# Altium schematic sheet Interfaces.SchDoc: PSM Interfaces
size A4; Author: SCH Originator; CompanyName: Invenco Group Ltd; DrawnBy: PCB Originator; Address1: 7-11 Kawana Street; Address2: Northcote; Address3: Auckland 0627; Address4: New Zealand; Revision: Use ProjectOptions->Parameters->ProjectRevision; SheetNumber: 2; SheetTotal: 2; PageSetup: Record=PageOptions|CenterHorizontal=True|CenterVertical=True|PrintScale=0.97|XCorrection=1.00|YCorrection=1.00|PrintKind=0|BorderSize=5000000|LeftOffset=0|BottomOffset=0|Orientation=2|PaperLength=1000|PaperWidth=1000|Scale=100|PaperSource=7|PrintQuality=-4|MediaType=1|DitherType=10|PaperKind=A4|PrintScaleMode=1; ContactDetails: www.invenco.com; Designer: Jasper M-W
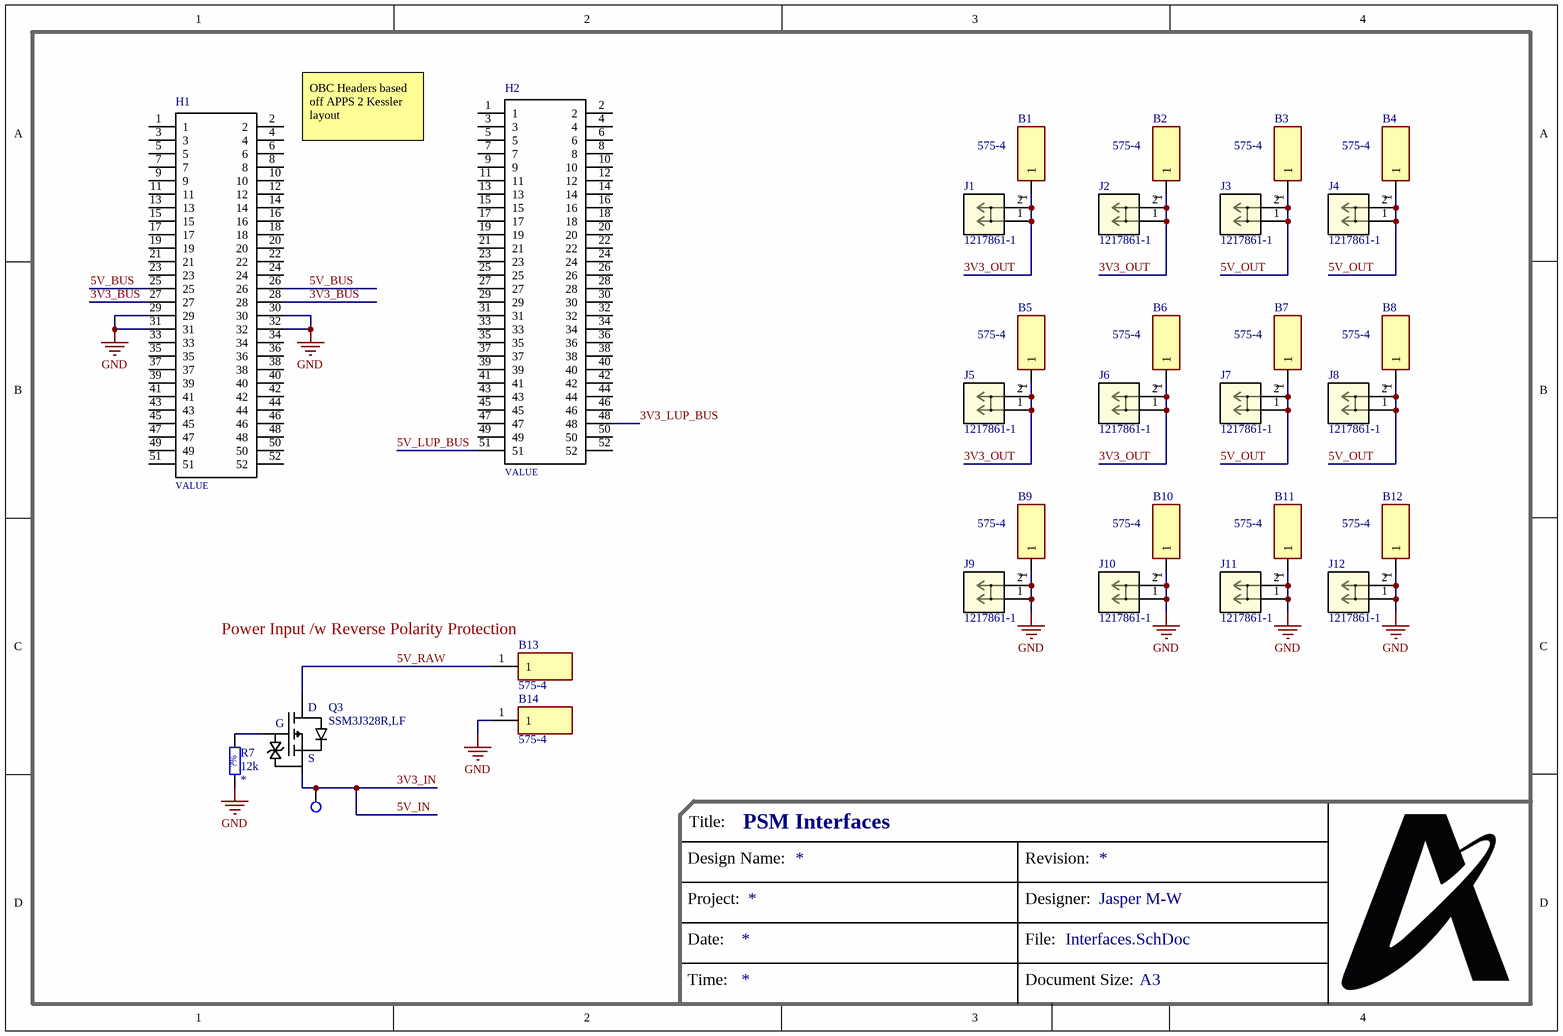
[diagram p0: Interfaces.SchDoc]

## Parts
B1  575-4  [5754]
B2  575-4  [5754]
B3  575-4  [5754]
B4  575-4  [5754]
B5  575-4  [5754]
B6  575-4  [5754]
B7  575-4  [5754]
B8  575-4  [5754]
B9  575-4  [5754]
B10  575-4  [5754]
B11  575-4  [5754]
B12  575-4  [5754]
B13  575-4  [5754]
B14  575-4  [5754]
H1  ESQ-126-14-G-D  [*SAMTEC_ESQ-126-14-G-D]  (value not drawn)
H2  ESQ-126-14-G-D  [*SAMTEC_ESQ-126-14-G-D]  (value not drawn)
J1  1217861-1  [CONN_1217861-1_TEC]
J2  1217861-1  [CONN_1217861-1_TEC]
J3  1217861-1  [CONN_1217861-1_TEC]
J4  1217861-1  [CONN_1217861-1_TEC]
J5  1217861-1  [CONN_1217861-1_TEC]
J6  1217861-1  [CONN_1217861-1_TEC]
J7  1217861-1  [CONN_1217861-1_TEC]
J8  1217861-1  [CONN_1217861-1_TEC]
J9  1217861-1  [CONN_1217861-1_TEC]
J10  1217861-1  [CONN_1217861-1_TEC]
J11  1217861-1  [CONN_1217861-1_TEC]
J12  1217861-1  [CONN_1217861-1_TEC]
Q3  SSM3J328R,LF  [SOT23F-3-0.8mm]
R7  12k  [RESISTOR_0805_2012M-50N]
T1  Test Pad  [Test Pad]  (value not drawn)  (no BOM)

## Nets
GND: B9.1 B10.1 B11.1 B12.1 B14.1 H1.29 H1.30 H1.31 H1.32 J9.1 J9.2 J10.1 J10.2 J11.1 J11.2 J12.1 J12.2 R7.1
3V3_BUS: H1.27 H1.28
3V3_IN: Q3.2(S) T1.1  [also labelled 5V_IN]
3V3_LUP_BUS: H2.48
3V3_OUT: B1.1 B2.1 B5.1 B6.1 J1.1 J1.2 J2.1 J2.2 J5.1 J5.2 J6.1 J6.2
5V_BUS: H1.25 H1.26
5V_LUP_BUS: H2.51
5V_OUT: B3.1 B4.1 B7.1 B8.1 J3.1 J3.2 J4.1 J4.2 J7.1 J7.2 J8.1 J8.2
5V_RAW: B13.1 Q3.3(D)
NetQ3_1: Q3.1(G) R7.2

Not connected (* = marked no-connect by the designer): H1 1 2 3 4 5 6 7 8 9 10 11 12 13 14 15 16 17 18 19 20 21 22 23 24 33 34 35 36 37 38 39 40 41 42 43 44 45 46 47 48 49 50 51 52; H2 1 2 3 4 5 6 7 8 9 10 11 12 13 14 15 16 17 18 19 20 21 22 23 24 25 26 27 28 29 30 31 32 33 34 35 36 37 38 39 40 41 42 43 44 45 46 47 49 50 52

## Notes on the sheet
- (near H1) OBC Headers based off APPS 2 Kessler layout
- (near B13) Power Input /w Reverse Polarity Protection
- Title:
- Design Name:
- Project:
- Revision:
- Designer:
- Date:
- Time:
- File:
- Document Size:
- A3
- (in symbol ESQ-126-14-G-D) VALUE

## Library data of the parts
B1-B14 = 575-4: Test Plugs & Test Jacks NON-INSUL JACK .218" BRASS NICKEL PLTD; Manufacturer_Name: Keystone Electronics; Geometry.Height: 2.49mm; Mouser Part Number: 534-575-4; Mouser Price/Stock: https://www.mouser.co.uk/ProductDetail/Keystone-Electronics/575-4?qs=w4ABFRoM%2FL8pPaUzIDyX8Q%3D%3D; Manufacturer_Part_Number: 575-4; Datasheet Link: https://www.keyelco.com/product.cfm/product_id/2379
H1 H2 = ESQ-126-14-G-D: S1PN: SAM11114-ND; MF: Samtec Inc.; MCR: 5.7A; MVP: Y; MVR: 550VAC; TEMP: -55°C ~ 125°C; MFPN: ESQ-126-14-G-D; S1L: https://www.digikey.co.nz/product-detail/en/samtec-inc/ESQ-126-14-G-D/SAM11114-ND/6695078
J1-J12 = 1217861-1: 250 FASTON,PCB TAB,TCBR; Manufacturer_Name: TE Connectivity; Copyright: Copyright (C) 2025 Ultra Librarian. All rights reserved.; Manufacturer_Part_Number: 1217861-1; RefDes: RefDes; Type: Type
Q3 = SSM3J328R,LF: Transistor - MOSFET, P-Channel SSM3J328R,LF; APSS Standard Part: APSS Standard; Temp Range: 0°C ~ 150°C (TJ); Rated Voltage: 20 Vds; Power: 1W; MF Part No.: SSM3J328R,LF; Package: SOT23-3; Supplier 1: Digikey; Supplier 1 Part No.: SSM3J328RLFCT-ND
R7 = Generic Resistor: Passive - Resistor, Generic; Tolerance: ?%; MF Part No.: *; Value: 12k